# EAGLE design xenlight (EAGLE 6.3)
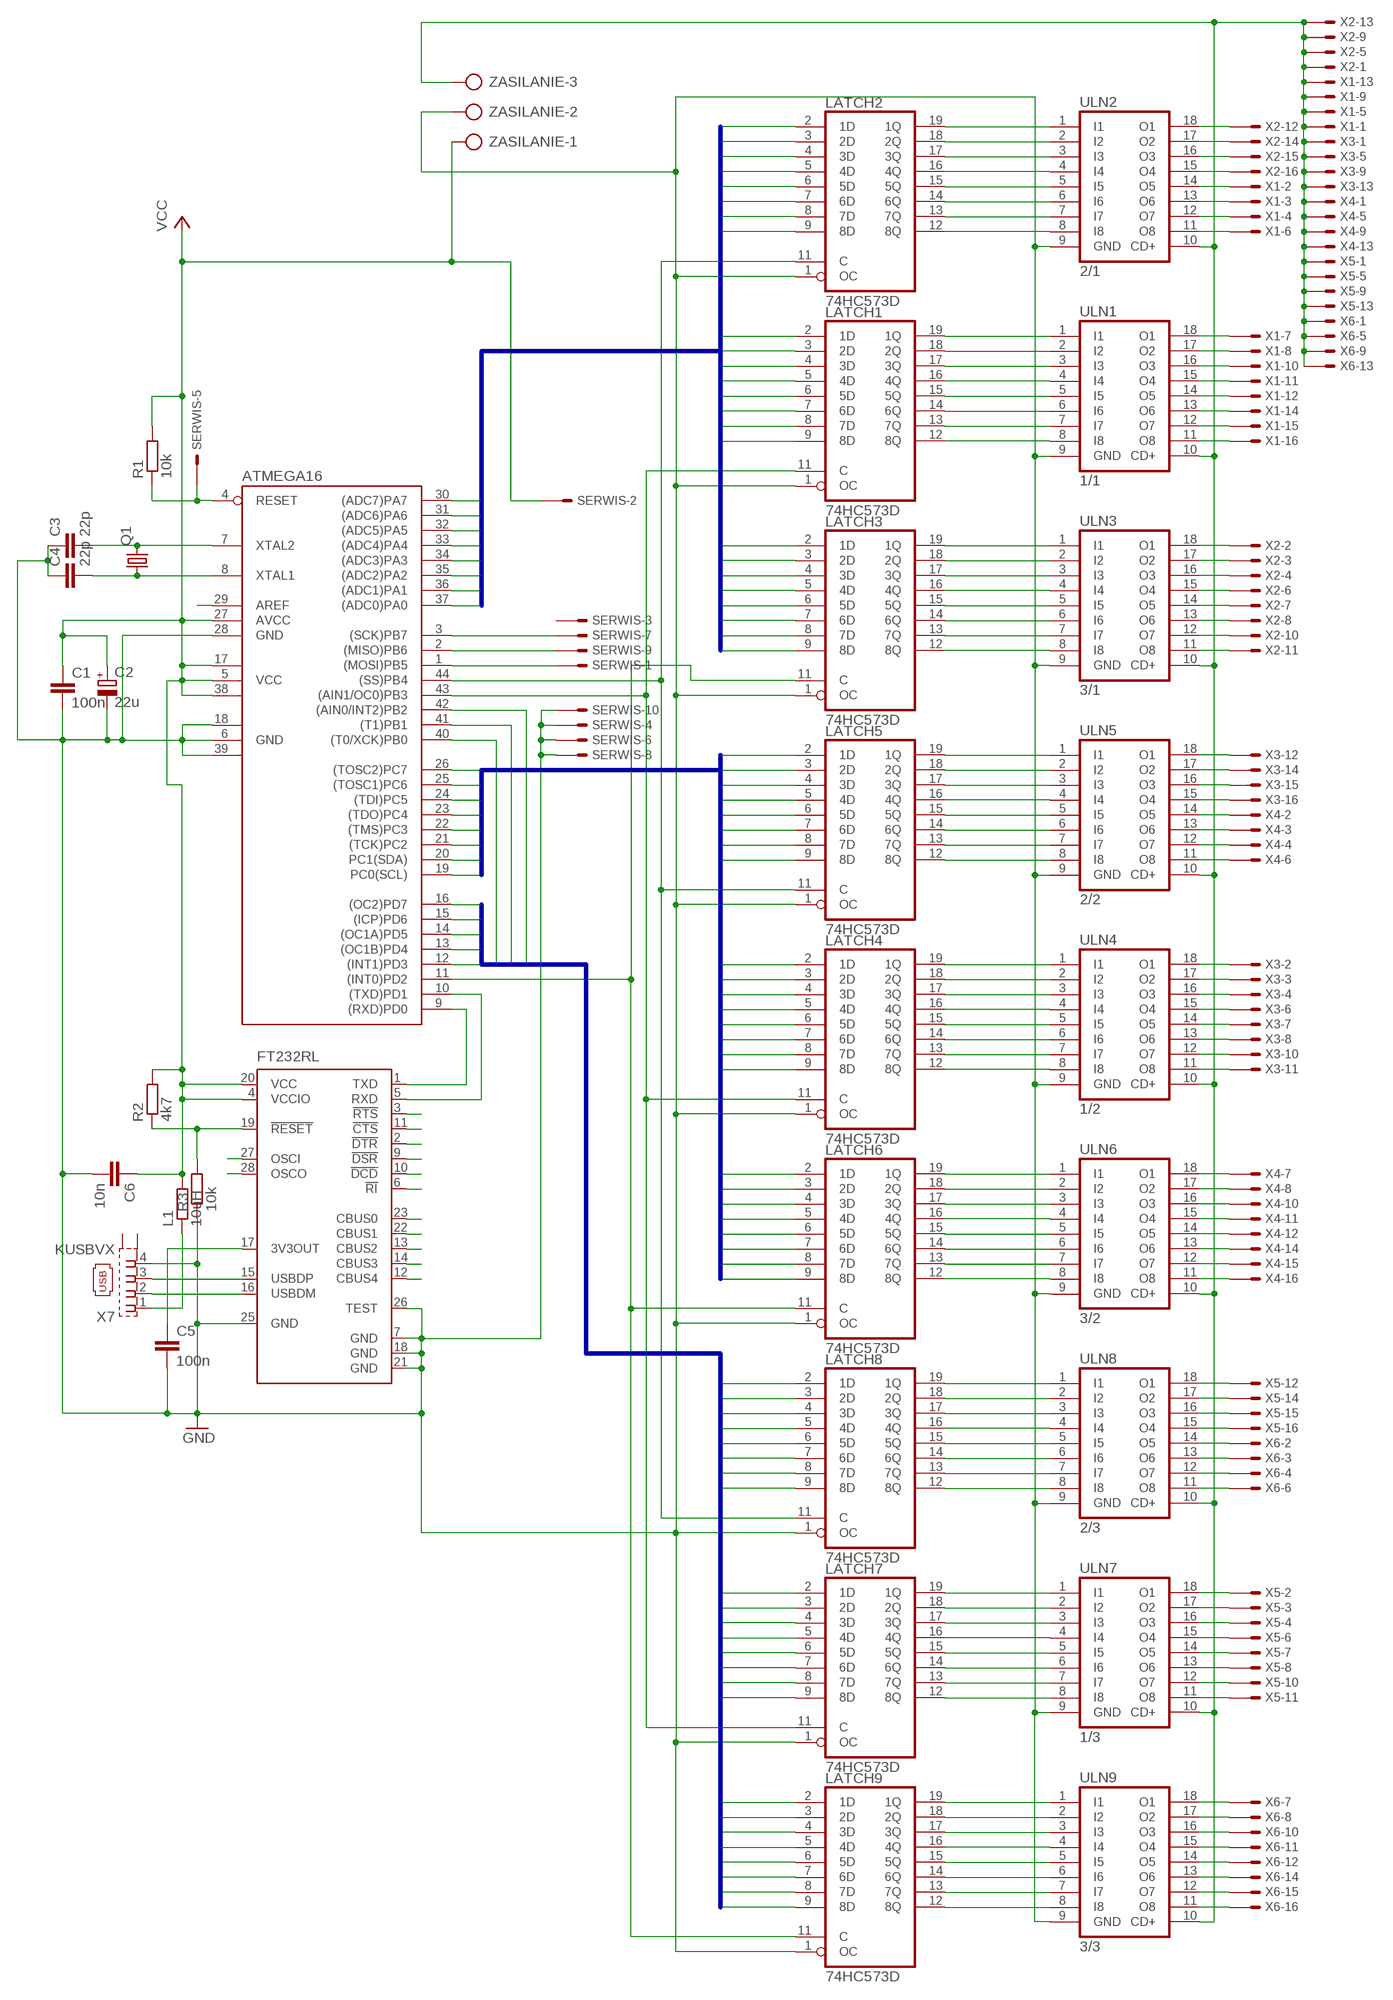
[diagram p0: schematic, sheet 1]

## Parts
ATMEGA16  MEGA16-A  [TQFP44]
C1  100n  C-EUC1206  [C1206]
C2  22u  CPOL-EUE1.8-4  [E1,8-4]
C3  22p  C-EUC1206  [C1206]
C4  22p  C-EUC1206  [C1206]
C5  100n  C-EUC1206  [C1206]
C6  10n  C-EUC1206  [C1206]
FT232RL  FT232RL  [SSOP28]
L1  10uH  R-EU_R1206  [R1206]
LATCH1  74HC573D  [SO20W]
LATCH2  74HC573D  [SO20W]
LATCH3  74HC573D  [SO20W]
LATCH4  74HC573D  [SO20W]
LATCH5  74HC573D  [SO20W]
LATCH6  74HC573D  [SO20W]
LATCH7  74HC573D  [SO20W]
LATCH8  74HC573D  [SO20W]
LATCH9  74HC573D  [SO20W]
Q1  CRYSTALHC49UP  [HC49UP]
R1  10k  R-EU_R0805  [R0805]
R2  4k7  R-EU_R0805  [R0805]
R3  10k  R-EU_R0805  [R0805]
SERWIS  057-010-1  [057-010-1]
ULN1  1/1  ULN2803ASOL18  [SO18W]
ULN2  2/1  ULN2803ASOL18  [SO18W]
ULN3  3/1  ULN2803ASOL18  [SO18W]
ULN4  1/2  ULN2803ASOL18  [SO18W]
ULN5  2/2  ULN2803ASOL18  [SO18W]
ULN6  3/2  ULN2803ASOL18  [SO18W]
ULN7  1/3  ULN2803ASOL18  [SO18W]
ULN8  2/3  ULN2803ASOL18  [SO18W]
ULN9  3/3  ULN2803ASOL18  [SO18W]
X1  057-016-1  [057-016-1]
X2  057-016-1  [057-016-1]
X3  057-016-1  [057-016-1]
X4  057-016-1  [057-016-1]
X5  057-016-1  [057-016-1]
X6  057-016-1  [057-016-1]
X7  KUSBVX  [KUSBVX]
ZASILANIE  AK300/3  [AK300/3]

## Nets
12V: ULN1.10(CD+) ULN2.10(CD+) ULN3.10(CD+) ULN4.10(CD+) ULN5.10(CD+) ULN6.10(CD+) ULN7.10(CD+) ULN8.10(CD+) ULN9.10(CD+) X1.1 X1.5 X1.9 X1.13 X2.1 X2.5 X2.9 X2.13 X3.1 X3.5 X3.9 X3.13 X4.1 X4.5 X4.9 X4.13 X5.1 X5.5 X5.9 X5.13 X6.1 X6.5 X6.9 X6.13 ZASILANIE.3
GND: ATMEGA16.6(GND) ATMEGA16.18(GND1) ATMEGA16.28(GND) ATMEGA16.39(GND2) C1.2 C2.- C3.1 C4.1 C5.2 C6.2 FT232RL.7(GND) FT232RL.18(GND) FT232RL.21(GND) FT232RL.25(GND) FT232RL.26(TEST) LATCH1.1(OC) LATCH2.1(OC) LATCH3.1(OC) LATCH4.1(OC) LATCH5.1(OC) LATCH6.1(OC) LATCH7.1(OC) LATCH8.1(OC) LATCH9.1(OC) R3.1 SERWIS.4 SERWIS.6 SERWIS.8 SERWIS.10 ULN1.9(GND) ULN2.9(GND) ULN3.9(GND) ULN4.9(GND) ULN5.9(GND) ULN6.9(GND) ULN7.9(GND) ULN8.9(GND) ULN9.9(GND) X7.4 ZASILANIE.2
N$1: ATMEGA16.30((ADC7)PA7) LATCH1.9(8D) LATCH2.9(8D) LATCH3.9(8D)
N$2: ATMEGA16.31((ADC6)PA6) LATCH1.8(7D) LATCH2.8(7D) LATCH3.8(7D)
N$3: ATMEGA16.32((ADC5)PA5) LATCH1.7(6D) LATCH2.7(6D) LATCH3.7(6D)
N$4: ATMEGA16.33((ADC4)PA4) LATCH1.6(5D) LATCH2.6(5D) LATCH3.6(5D)
N$5: ATMEGA16.34((ADC3)PA3) LATCH1.5(4D) LATCH2.5(4D) LATCH3.5(4D)
N$6: ATMEGA16.35((ADC2)PA2) LATCH1.4(3D) LATCH2.4(3D) LATCH3.4(3D)
N$7: ATMEGA16.36((ADC1)PA1) LATCH1.3(2D) LATCH2.3(2D) LATCH3.3(2D)
N$8: ATMEGA16.37((ADC0)PA0) LATCH1.2(1D) LATCH2.2(1D) LATCH3.2(1D)
N$9: ATMEGA16.26((TOSC2)PC7) LATCH4.2(1D) LATCH5.2(1D) LATCH6.2(1D)
N$10: ATMEGA16.25((TOSC1)PC6) LATCH4.3(2D) LATCH5.3(2D) LATCH6.3(2D)
N$11: ATMEGA16.24((TDI)PC5) LATCH4.4(3D) LATCH5.4(3D) LATCH6.4(3D)
N$12: ATMEGA16.23((TDO)PC4) LATCH4.5(4D) LATCH5.5(4D) LATCH6.5(4D)
N$13: ATMEGA16.22((TMS)PC3) LATCH4.6(5D) LATCH5.6(5D) LATCH6.6(5D)
N$14: ATMEGA16.21((TCK)PC2) LATCH4.7(6D) LATCH5.7(6D) LATCH6.7(6D)
N$15: ATMEGA16.20(PC1(SDA)) LATCH4.8(7D) LATCH5.8(7D) LATCH6.8(7D)
N$16: ATMEGA16.19(PC0(SCL)) LATCH4.9(8D) LATCH5.9(8D) LATCH6.9(8D)
N$17: ATMEGA16.16((OC2)PD7) LATCH7.2(1D) LATCH8.2(1D) LATCH9.2(1D)
N$18: ATMEGA16.15((ICP)PD6) LATCH7.3(2D) LATCH8.3(2D) LATCH9.3(2D)
N$19: ATMEGA16.14((OC1A)PD5) LATCH7.4(3D) LATCH8.4(3D) LATCH9.4(3D)
N$20: ATMEGA16.13((OC1B)PD4) LATCH7.5(4D) LATCH8.5(4D) LATCH9.5(4D)
N$21: ATMEGA16.12((INT1)PD3) LATCH7.6(5D) LATCH8.6(5D) LATCH9.6(5D)
N$22: ATMEGA16.44((SS)PB4) LATCH2.11(C) LATCH5.11(C) LATCH8.11(C)
N$23: ATMEGA16.43((AIN1/OC0)PB3) LATCH1.11(C) LATCH4.11(C) LATCH7.11(C)
N$24: LATCH2.19(1Q) ULN2.1(I1)
N$25: LATCH2.18(2Q) ULN2.2(I2)
N$26: LATCH2.17(3Q) ULN2.3(I3)
N$27: LATCH2.16(4Q) ULN2.4(I4)
N$28: LATCH2.15(5Q) ULN2.5(I5)
N$29: LATCH2.14(6Q) ULN2.6(I6)
N$30: LATCH2.13(7Q) ULN2.7(I7)
N$31: LATCH2.12(8Q) ULN2.8(I8)
N$32: LATCH1.19(1Q) ULN1.1(I1)
N$33: LATCH1.18(2Q) ULN1.2(I2)
N$34: LATCH1.17(3Q) ULN1.3(I3)
N$35: LATCH1.16(4Q) ULN1.4(I4)
N$36: LATCH1.15(5Q) ULN1.5(I5)
N$37: LATCH1.14(6Q) ULN1.6(I6)
N$38: LATCH1.13(7Q) ULN1.7(I7)
N$39: LATCH1.12(8Q) ULN1.8(I8)
N$40: LATCH5.19(1Q) ULN5.1(I1)
N$41: LATCH5.18(2Q) ULN5.2(I2)
N$42: LATCH5.17(3Q) ULN5.3(I3)
N$43: LATCH5.16(4Q) ULN5.4(I4)
N$44: LATCH5.15(5Q) ULN5.5(I5)
N$45: LATCH5.14(6Q) ULN5.6(I6)
N$46: LATCH5.13(7Q) ULN5.7(I7)
N$47: LATCH3.19(1Q) ULN3.1(I1)
N$48: LATCH4.19(1Q) ULN4.1(I1)
N$49: LATCH4.18(2Q) ULN4.2(I2)
N$50: LATCH4.17(3Q) ULN4.3(I3)
N$51: LATCH4.16(4Q) ULN4.4(I4)
N$52: LATCH4.15(5Q) ULN4.5(I5)
N$53: LATCH4.14(6Q) ULN4.6(I6)
N$54: LATCH4.13(7Q) ULN4.7(I7)
N$55: LATCH4.12(8Q) ULN4.8(I8)
N$56: LATCH8.19(1Q) ULN8.1(I1)
N$57: LATCH8.18(2Q) ULN8.2(I2)
N$58: LATCH8.17(3Q) ULN8.3(I3)
N$59: LATCH8.16(4Q) ULN8.4(I4)
N$60: LATCH8.15(5Q) ULN8.5(I5)
N$61: LATCH3.18(2Q) ULN3.2(I2)
N$62: ULN4.18(O1) X3.2
N$63: LATCH3.17(3Q) ULN3.3(I3)
N$64: LATCH7.19(1Q) ULN7.1(I1)
N$65: LATCH7.18(2Q) ULN7.2(I2)
N$66: LATCH7.17(3Q) ULN7.3(I3)
N$67: LATCH7.16(4Q) ULN7.4(I4)
N$68: LATCH7.15(5Q) ULN7.5(I5)
N$69: LATCH3.16(4Q) ULN3.4(I4)
N$70: LATCH3.15(5Q) ULN3.5(I5)
N$71: LATCH3.14(6Q) ULN3.6(I6)
N$72: LATCH3.13(7Q) ULN3.7(I7)
N$73: LATCH3.12(8Q) ULN3.8(I8)
N$74: ATMEGA16.11((INT0)PD2) LATCH3.11(C) LATCH6.11(C) LATCH9.11(C)
N$75: LATCH6.19(1Q) ULN6.1(I1)
N$76: LATCH6.18(2Q) ULN6.2(I2)
N$77: LATCH6.17(3Q) ULN6.3(I3)
N$78: LATCH6.16(4Q) ULN6.4(I4)
N$79: LATCH6.15(5Q) ULN6.5(I5)
N$80: LATCH6.14(6Q) ULN6.6(I6)
N$81: LATCH6.13(7Q) ULN6.7(I7)
N$82: LATCH6.12(8Q) ULN6.8(I8)
N$83: ATMEGA16.29(AREF)
N$84: LATCH9.19(1Q) ULN9.1(I1)
N$85: LATCH9.18(2Q) ULN9.2(I2)
N$86: LATCH9.17(3Q) ULN9.3(I3)
N$87: LATCH9.16(4Q) ULN9.4(I4)
N$88: LATCH9.15(5Q) ULN9.5(I5)
N$89: LATCH9.14(6Q) ULN9.6(I6)
N$90: LATCH9.13(7Q) ULN9.7(I7)
N$91: LATCH9.12(8Q) ULN9.8(I8)
N$92: ULN3.18(O1) X2.2
N$93: ULN3.17(O2) X2.3
N$94: ULN3.16(O3) X2.4
N$95: ULN3.15(O4) X2.6
N$96: ULN3.14(O5) X2.7
N$97: ULN3.13(O6) X2.8
N$98: ULN3.12(O7) X2.10
N$99: ULN3.11(O8) X2.11
N$100: ULN2.18(O1) X2.12
N$101: ULN2.17(O2) X2.14
N$102: ULN2.16(O3) X2.15
N$103: ULN2.15(O4) X2.16
N$104: ULN2.14(O5) X1.2
N$105: ATMEGA16.3((SCK)PB7) SERWIS.7
N$106: ATMEGA16.2((MISO)PB6) SERWIS.9
N$107: ATMEGA16.1((MOSI)PB5) SERWIS.1
N$108: ULN2.13(O6) X1.3
N$109: ULN2.12(O7) X1.4
N$110: LATCH5.12(8Q) ULN5.8(I8)
N$111: ULN2.11(O8) X1.6
N$112: ULN1.18(O1) X1.7
N$113: ULN1.17(O2) X1.8
N$115: ULN1.16(O3) X1.10
N$116: ULN1.15(O4) X1.11
N$117: ATMEGA16.8(XTAL1) C4.2 Q1.1
N$118: ATMEGA16.7(XTAL2) C3.2 Q1.2
N$119: FT232RL.15(USBDP) X7.3
N$120: ATMEGA16.9((RXD)PD0) FT232RL.1(TXD)
N$121: ATMEGA16.10((TXD)PD1) FT232RL.5(RXD)
N$122: FT232RL.16(USBDM) X7.2
N$123: L1.1 X7.1
N$124: LATCH8.14(6Q) ULN8.6(I6)
N$125: FT232RL.19(!RESET) R2.1 R3.2
N$126: C5.1 FT232RL.17(3V3OUT)
N$127: ATMEGA16.4(RESET) R1.1 SERWIS.5
N$128: LATCH8.13(7Q) ULN8.7(I7)
N$129: LATCH8.12(8Q) ULN8.8(I8)
N$130: LATCH7.14(6Q) ULN7.6(I6)
N$131: LATCH7.13(7Q) ULN7.7(I7)
N$132: LATCH7.12(8Q) ULN7.8(I8)
N$133: ULN1.14(O5) X1.12
N$134: ULN1.13(O6) X1.14
N$135: ULN1.12(O7) X1.15
N$136: ULN1.11(O8) X1.16
N$137: ULN4.17(O2) X3.3
N$138: FT232RL.3(!RTS)
N$139: FT232RL.11(!CTS)
N$140: FT232RL.2(!DTR)
N$141: FT232RL.9(!DSR)
N$142: FT232RL.10(!DCD)
N$143: FT232RL.6(!RI)
N$144: ATMEGA16.42((AIN0/INT2)PB2) LATCH7.7(6D) LATCH8.7(6D) LATCH9.7(6D)
N$145: ATMEGA16.41((T1)PB1) LATCH7.8(7D) LATCH8.8(7D) LATCH9.8(7D)
N$146: ATMEGA16.40((T0/XCK)PB0) LATCH7.9(8D) LATCH8.9(8D) LATCH9.9(8D)
N$147: FT232RL.23(CBUS0)
N$148: FT232RL.22(CBUS1)
N$149: FT232RL.13(CBUS2)
N$150: FT232RL.14(CBUS3)
N$151: FT232RL.12(CBUS4)
N$152: FT232RL.27(OSCI)
N$153: FT232RL.28(OSCO)
N$154: ULN4.16(O3) X3.4
N$155: ULN4.15(O4) X3.6
N$156: ULN4.14(O5) X3.7
N$157: ULN4.13(O6) X3.8
N$158: ULN4.12(O7) X3.10
N$159: ULN4.11(O8) X3.11
N$160: ULN5.18(O1) X3.12
N$161: ULN5.17(O2) X3.14
N$162: ULN5.16(O3) X3.15
N$163: ULN5.15(O4) X3.16
N$164: ULN5.14(O5) X4.2
N$165: ULN5.13(O6) X4.3
N$166: ULN5.12(O7) X4.4
N$167: ULN5.11(O8) X4.6
N$168: ULN6.18(O1) X4.7
N$169: ULN6.17(O2) X4.8
N$170: ULN6.16(O3) X4.10
N$171: ULN6.15(O4) X4.11
N$172: ULN6.14(O5) X4.12
N$173: ULN6.13(O6) X4.14
N$174: ULN6.12(O7) X4.15
N$175: ULN6.11(O8) X4.16
N$176: ULN7.18(O1) X5.2
N$177: ULN7.17(O2) X5.3
N$178: ULN7.16(O3) X5.4
N$179: ULN7.15(O4) X5.6
N$180: ULN7.14(O5) X5.7
N$181: ULN7.13(O6) X5.8
N$182: ULN7.12(O7) X5.10
N$183: ULN7.11(O8) X5.11
N$184: ULN8.18(O1) X5.12
N$185: ULN8.17(O2) X5.14
N$186: ULN8.16(O3) X5.15
N$187: ULN8.15(O4) X5.16
N$188: ULN8.14(O5) X6.2
N$189: ULN8.13(O6) X6.3
N$190: ULN8.12(O7) X6.4
N$191: ULN8.11(O8) X6.6
N$192: ULN9.18(O1) X6.7
N$193: ULN9.17(O2) X6.8
N$194: ULN9.16(O3) X6.10
N$195: ULN9.15(O4) X6.11
N$196: ULN9.14(O5) X6.12
N$197: ULN9.13(O6) X6.14
N$198: ULN9.12(O7) X6.15
N$199: ULN9.11(O8) X6.16
VCC: ATMEGA16.5(VCC) ATMEGA16.17(VCC1) ATMEGA16.27(AVCC) ATMEGA16.38(VCC2) C1.1 C2.+ C6.1 FT232RL.4(VCCIO) FT232RL.20(VCC) L1.2 R1.2 R2.2 SERWIS.2 ZASILANIE.1
Unconnected: SERWIS.3 X7.M1(S1) X7.M2(S2)

## Buses
N$[9..16]
N$[1..8]
N$[17..21],N$[144..146]

## Power pins joined to a net without a drawn wire
GND: LATCH1.10(GND) LATCH2.10(GND) LATCH3.10(GND) LATCH4.10(GND) LATCH5.10(GND) LATCH6.10(GND) LATCH7.10(GND) LATCH8.10(GND) LATCH9.10(GND)
VCC: LATCH1.20(VCC) LATCH2.20(VCC) LATCH3.20(VCC) LATCH4.20(VCC) LATCH5.20(VCC) LATCH6.20(VCC) LATCH7.20(VCC) LATCH8.20(VCC) LATCH9.20(VCC)

## Library data of the parts
ATMEGA16 = atmel:MEGA16: MICROCONTROLLER 16 Kbytes FLASH 1 kbytes SRAM 512 bytes EEPROM USART 8-channel 10 bit ADC Source: avr.lbr; MPN: ATMEGA16-16AU; OC_FARNELL: 9171134; OC_NEWARK: 96K6515
C1 C3-C6 = rcl:C-EU: CAPACITOR, European symbol
C2 = rcl:CPOL-EU: POLARIZED CAPACITOR, European symbol
FT232RL = ftdichip:FT232R: Source: http://www.ftdichip.com/Documents/DataSheets/DS_FT232R_v104.pdf; MPN: FT232RL; OC_FARNELL: 1146032; OC_NEWARK: 91K9918
L1 R1-R3 = rcl:R-EU_: RESISTOR, European symbol
LATCH1-LATCH9 = 74xx-eu:74*573: 8-bit D latch BUS DRIVER
Q1 = crystal:CRYSTAL: CRYSTAL; OC_FARNELL: unknown; OC_NEWARK: unknown
SERWIS = con-panduit:057-010-: CONNECTOR 10-pin series 057 contact pc board low profile headers; OC_FARNELL: unknown; OC_NEWARK: unknown
ULN1-ULN9 = uln-udn2:ULN2803A: DRIVER ARRAY
X1-X6 = con-panduit:057-016-: CONNECTOR 10-pin series 057 contact pc board low profile headers; OC_FARNELL: unknown; OC_NEWARK: unknown
X7 = con-kycon:KUSBVX: Vertical,Top Entry Universal Serial Bus Connector KUSBVX Series Source: KYCON Sibalco USB vertical socket KUSBV.pdf
ZASILANIE = con-ptr500:AK300/3: CONNECTOR; OC_FARNELL: unknown; OC_NEWARK: unknown

## Board
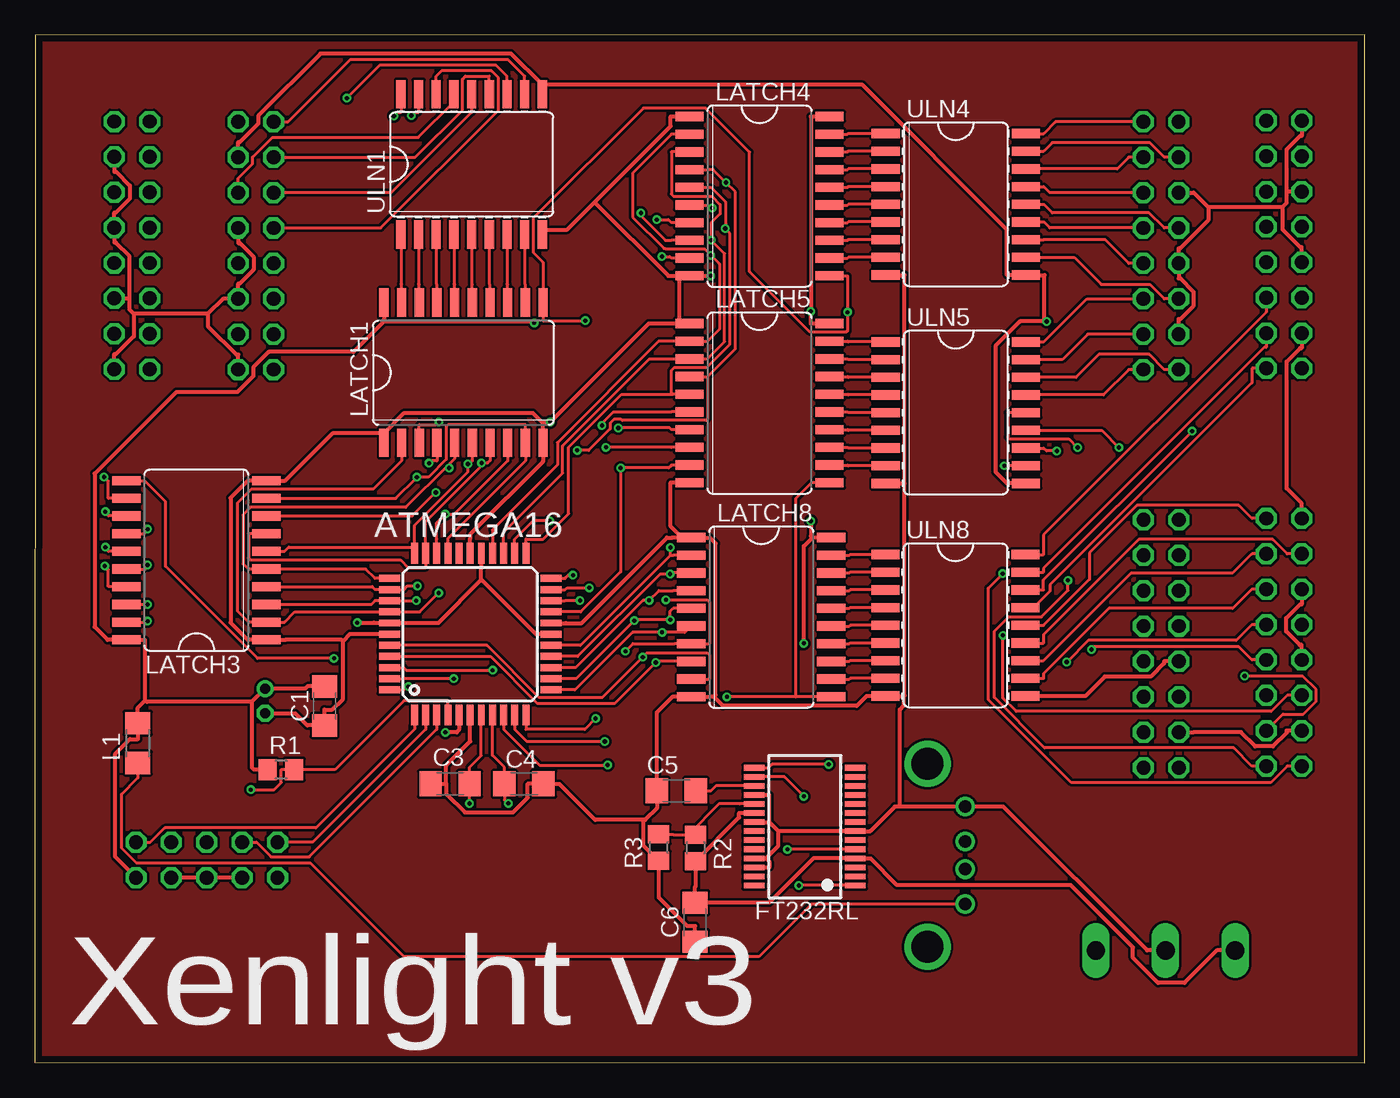
[diagram p1: board, top side]
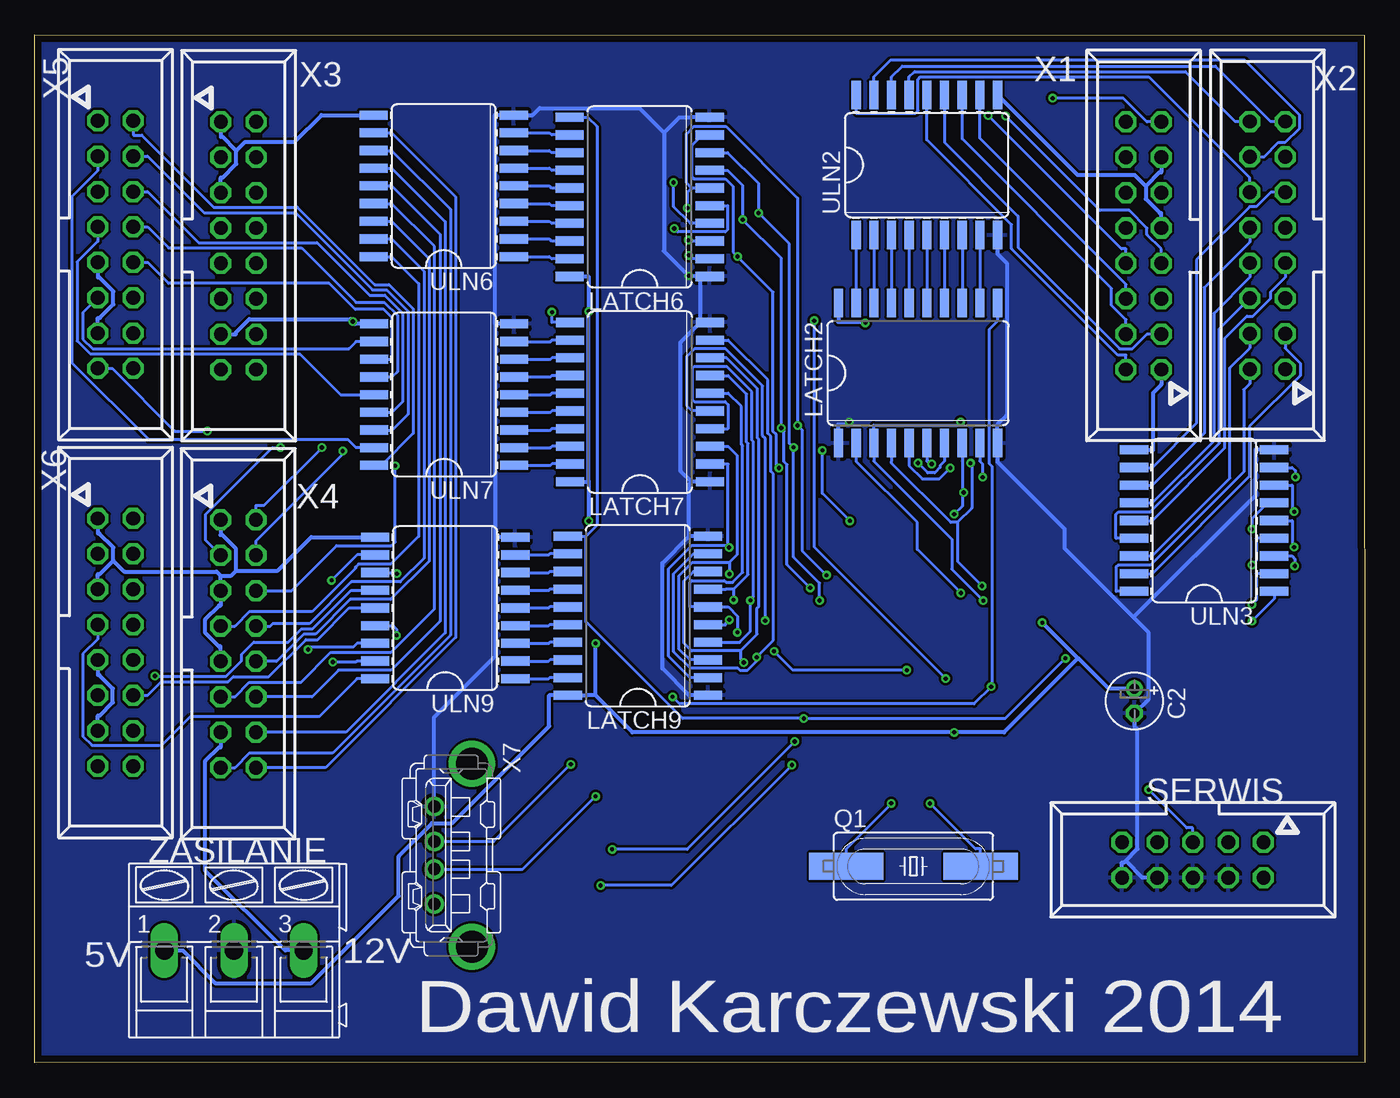
[diagram p2: board, bottom side, seen from below]

Size 95.51 x 73.81 mm. Coordinates in mm from the lower left corner, seen from the top.
Outline: 0,0.05 95.51,0 95.51,73.81 0.02,73.79 0,0.05
Copper layers (1*16): Top 0.035mm / dielectric 1.5mm / Bottom 0.035mm
Design rules "EagleRules_SmartPrototyping": minimum track width 7mil, minimum drill 12mil, track to track 7mil, track to pad 7mil, pad to pad 7mil, via to via 7mil, smd to smd 0mil, copper to edge 20mil, drill to drill 10mil, minimum pad ring 10mil, minimum via ring 6mil, stop-mask expansion 2mil, vias tented up to drill 25mil, thermal gap 10mil

### Footprints (pad centres in the part's own frame; a part is rotated, then mirrored left to right if it is on the bottom)
TQFP44 = smd 1.5 x 0.5: 1 -5.8,4; 2 -5.8,3.2; 3 -5.8,2.4; 4 -5.8,1.6; 5 -5.8,0.8; 6 -5.8,0; 7 -5.8,-0.8; 8 -5.8,-1.6; 9 -5.8,-2.4; 10 -5.8,-3.2; 11 -5.8,-4; 23 5.8,-4; 24 5.8,-3.2; 25 5.8,-2.4; 26 5.8,-1.6; 27 5.8,-0.8; 28 5.8,0; 29 5.8,0.8; 30 5.8,1.6; 31 5.8,2.4; 32 5.8,3.2; 33 5.8,4 | smd 0.5 x 1.5: 12 -4,-5.8; 13 -3.2,-5.8; 14 -2.4,-5.8; 15 -1.6,-5.8; 16 -0.8,-5.8; 17 0,-5.8; 18 0.8,-5.8; 19 1.6,-5.8; 20 2.4,-5.8; 21 3.2,-5.8; 22 4,-5.8; 34 4,5.8; 35 3.2,5.8; 36 2.4,5.8; 37 1.6,5.8; 38 0.8,5.8; 39 0,5.8; 40 -0.8,5.8; 41 -1.6,5.8; 42 -2.4,5.8; 43 -3.2,5.8; 44 -4,5.8
C1206 = smd 1.6 x 1.8: 1 -1.4,0; 2 1.4,0
E1,8-4 = drill 0.711 pad 1.168: + -0.889,0 | drill 0.711 pad 1.168 octagon: - 0.889,0
SSOP28 = smd 0.4 x 1.5: 1 -4.225,-3.625; 2 -3.575,-3.625; 3 -2.925,-3.625; 4 -2.275,-3.625; 5 -1.625,-3.625; 6 -0.975,-3.625; 7 -0.325,-3.625; 8 0.325,-3.625; 9 0.975,-3.625; 10 1.625,-3.625; 11 2.275,-3.625; 12 2.925,-3.625; 13 3.575,-3.625; 14 4.225,-3.625; 15 4.225,3.625; 16 3.575,3.625; 17 2.925,3.625; 18 2.275,3.625; 19 1.625,3.625; 20 0.975,3.625; 21 0.325,3.625; 22 -0.325,3.625; 23 -0.975,3.625; 24 -1.625,3.625; 25 -2.275,3.625; 26 -2.925,3.625; 27 -3.575,3.625; 28 -4.225,3.625
R1206 = smd 1.6 x 1.803: 1 -1.422,0; 2 1.422,0
SO20W = smd 0.66 x 2.032: 1 -5.715,-5.029; 2 -4.445,-5.029; 3 -3.175,-5.029; 4 -1.905,-5.029; 5 -0.635,-5.029; 6 0.635,-5.029; 7 1.905,-5.029; 8 3.175,-5.029; 9 4.445,-5.029; 10 5.715,-5.029; 11 5.715,5.029; 12 4.445,5.029; 13 3.175,5.029; 14 1.905,5.029; 15 0.635,5.029; 16 -0.635,5.029; 17 -1.905,5.029; 18 -3.175,5.029; 19 -4.445,5.029; 20 -5.715,5.029
HC49UP = smd 5.334 x 1.93: 1 -4.826,0; 2 4.826,0
R0805 = smd 1.3 x 1.5: 1 -0.95,0; 2 0.95,0
057-010-1 = drill 1 octagon: 1 -5.08,-1.27; 2 -5.08,1.27; 3 -2.54,-1.27; 4 -2.54,1.27; 5 0,-1.27; 6 0,1.27; 7 2.54,-1.27; 8 2.54,1.27; 9 5.08,-1.27; 10 5.08,1.27
SO18W = smd 0.66 x 2.032: 1 -5.08,-5.029; 2 -3.81,-5.029; 3 -2.54,-5.029; 4 -1.27,-5.029; 5 0,-5.029; 6 1.27,-5.029; 7 2.54,-5.029; 8 3.81,-5.029; 9 5.08,-5.029; 10 5.08,5.029; 11 3.81,5.029; 12 2.54,5.029; 13 1.27,5.029; 14 0,5.029; 15 -1.27,5.029; 16 -2.54,5.029; 17 -3.81,5.029; 18 -5.08,5.029
057-016-1 = drill 1 octagon: 1 -8.89,-1.27; 2 -8.89,1.27; 3 -6.35,-1.27; 4 -6.35,1.27; 5 -3.81,-1.27; 6 -3.81,1.27; 7 -1.27,-1.27; 8 -1.27,1.27; 9 1.27,-1.27; 10 1.27,1.27; 11 3.81,-1.27; 12 3.81,1.27; 13 6.35,-1.27; 14 6.35,1.27; 15 8.89,-1.27; 16 8.89,1.27
KUSBVX = drill 0.9 pad 1.3: 1 3.5,0; 2 1,0; 3 -1,0; 4 -3.5,0 | drill 2.3 pad 2.8: M1 -6.57,2.71; M2 6.57,2.71
AK300/3 = drill 1.321 long: 1 -5.004,0; 2 0,0; 3 5.004,0

### Placement (x,y rotation side)
ATMEGA16  31.27,30.78 90 top
C1  20.8,25.63 270 top
C2  16.54,25.98 270 bottom
C3  29.82,20.04 0 top
C4  35.13,20.04 180 top
C5  46.08,19.53 180 top
C6  47.42,10.11 270 top
FT232RL  55.3,16.97 90 top
L1  7.39,22.96 90 top
LATCH1  30.78,49.56 0 top
LATCH2  32.08,49.53 0 bottom
LATCH3  11.61,36.09 90 top
LATCH4  52.04,62.23 270 top
LATCH5  52.04,47.37 270 top
LATCH6  52.07,62.18 90 bottom
LATCH7  52.04,47.45 90 bottom
LATCH8  52.17,32 270 top
LATCH9  52.2,32.11 90 bottom
Q1  32.41,14.12 0 bottom
R1  17.68,21.06 180 top
R2  47.45,15.44 270 top
R3  44.81,15.47 90 top
SERWIS  12.34,14.58 180 bottom
ULN1  31.37,64.52 0 top
ULN2  31.45,64.47 0 bottom
ULN3  11.53,38.94 90 bottom
ULN4  66.14,61.65 270 top
ULN5  66.14,46.69 270 top
ULN6  66.14,62.97 90 bottom
ULN7  66.12,47.98 90 bottom
ULN8  66.12,31.42 270 top
ULN9  66.04,32.66 90 bottom
X1  15.87,58.67 90 bottom
X2  6.99,58.7 90 bottom
X3  80.87,58.67 270 bottom
X4  80.9,30.1 270 bottom
X5  89.71,58.75 270 bottom
X6  89.71,30.2 270 bottom
X7  66.83,14.91 270 bottom
ZASILANIE  81.2,8.08 0 bottom

### Tracks (layer width: path | path; a pad name or v marks a point on that pad's centre or on a via)
12V  (via drill 0.3 pad 0.61)
  Top 0.305: X1.9 14.6,58.86 14.74,58.86 15.72,57.88 15.72,56.95 14.72,55.95 14.6,55.95 X1.5 13.52,54.86 12.43,53.77 | 36.45,70.22 34.2,72.47 20.52,72.47 16.05,68 16.05,67.44 14.72,66.11 14.6,66.11 X1.13 | 36.45,70.22 59.44,70.22 69.82,59.83 69.82,56.57 ULN4.10 72.52,56.57 72.52,53.24 | 72.52,53.24 v72.67,53.24 | 72.52,53.24 70.76,53.24 69,51.47 69,42.43 69.82,41.6 ULN5.10 | ULN1.10 36.45,70.22 | X5.1 90.98,66.56 90.87,66.56 89.9,65.58 89.9,62.56 | 89.59,61.44 89.9,61.75 89.9,62.56 | X6.5 90.98,32.93 90.87,32.93 89.87,31.93 89.87,30.99 90.85,30.02 90.98,30.02 X6.9 | X4.9 81.09,28.83 81.09,28.69 80.14,27.75 76.84,27.75 75.43,26.34 ULN8.10 | X2.13 5.71,63.96 5.85,63.96 6.83,62.99 6.83,62.05 5.83,61.05 5.71,61.05 X2.9 5.71,58.88 5.83,58.88 6.8,57.91 6.8,54.89 | 7.11,53.77 6.8,54.08 6.8,54.89 | 7.11,53.77 7.11,52.17 5.83,50.89 5.71,50.89 X2.1 | 12.43,53.77 7.11,53.77 | X5.13 90.98,51.32 90.87,51.32 89.9,50.34 89.9,41.26 90.98,40.17 X6.1 | 89.59,61.44 89.59,59.84 90.87,58.56 90.98,58.56 X5.9 | 89.59,61.44 84.27,61.44 | X3.13 82.14,53.41 82.28,53.41 83.23,54.36 83.23,55.34 82.26,56.32 82.14,56.32 X3.9 82.14,58.49 82.26,58.49 84.27,60.5 84.27,61.44 | 84.27,61.44 83.23,62.48 X3.5 | 12.43,53.77 12.43,52.9 14.46,50.87 14.6,50.87 X1.1 | X2.5 6.8,54.89 | X5.5 89.9,62.56 | X4.13 83.25,23.75 86.62,23.75 87.64,22.73 88.91,22.73 89.9,23.71 89.9,23.85 X6.13
  Bottom 0.305: X6.9 90.98,27.85 90.87,27.85 89.9,26.87 89.9,25.88 90.85,24.94 90.98,24.94 X6.13 | X4.9 82.17,29.91 82.3,29.91 83.26,30.87 83.26,31.85 82.28,32.82 82.17,32.82 X4.5 82.17,34.99 | 89.87,36.07 89.87,37.01 90.87,38.01 90.98,38.01 X6.1 | 89.87,36.07 90.85,35.09 90.98,35.09 X6.5 | 89.87,36.07 89.08,35.28 82.46,35.28 82.17,34.99 | ULN7.10 72.49,53.06 v72.67,53.24 72.84,53.41 80.11,53.41 81.06,52.46 81.06,52.32 X3.13 | 81.06,35.34 81.06,36.91 82.06,37.9 82.17,37.9 X4.1 | 82.17,34.99 81.41,34.99 81.06,35.34 | 81.06,35.34 78.06,35.34 75.66,37.74 ULN9.10 | 15.73,62.95 15.73,62.04 14.72,61.03 14.6,61.03 X1.9 | 15.73,62.95 14.74,63.94 14.6,63.94 X1.13 | ULN2.10 20.62,63.75 16.54,63.75 15.73,62.95 | X5.9 90.98,56.4 90.87,56.4 89.87,55.4 89.87,54.46 90.85,53.48 90.98,53.48 X5.13 | X4.13 82.17,22.67 82.28,22.67 83.26,21.69 83.26,13.82 77.52,8.08 ZASILANIE.3 | ULN3.10 15.21,44.02 15.21,48.09 14.6,48.7 X1.1 | 81.03,65.48 82.03,66.48 82.14,66.48 X3.1 | 81.03,65.48 81.03,64.54 82.01,63.57 82.14,63.57 X3.5 | 81.03,65.48 80.39,66.12 76.84,66.12 74.91,68.05 ULN6.10
GND  (via drill 0.3 pad 0.61)
  Top 0.305: LATCH5.10 45.67,41.66 45.67,38.52 46.47,37.72 | 46.47,37.72 45.8,37.72 45.4,37.72 39.27,31.59 38.15,31.59 ATMEGA16.18 | 46.47,37.72 LATCH8.1 48.49,37.72 48.9,37.31 48.9,26.42 48.76,26.29 | 62.46,41.6 62.46,56.57 ULN4.9 | 62.43,26.34 62.46,26.37 62.46,41.6 | ULN5.9 62.46,41.6 | v48.55,56.52 48.36,56.52 LATCH4.10 46.26,56.52 | 46.26,53.09 44.08,53.09 v37.03,46.03 36.61,46.03 36.5,45.93 | LATCH5.1 46.26,53.09 | 40.21,61.8 45.5,56.52 46.26,56.52 | 46.26,56.52 46.26,53.09 | LATCH4.1 45.67,67.95 45.67,67.26 40.21,61.8 | 40.21,61.8 38.23,59.82 36.45,59.82 ULN1.9 | 25.07,45.2 26.54,46.67 35.76,46.67 36.5,45.93 | 36.5,45.93 36.5,45.87 LATCH1.10 36.5,43.18 31.27,37.95 31.27,37.66 ATMEGA16.28 | 62.12,18.41 62.12,25.37 62.43,25.68 62.43,26.34 | 62.43,26.34 ULN8.9 59.74,26.34 59.03,25.63 49.42,25.63 48.76,26.29 | 48.76,26.29 48.49,26.29 LATCH8.10 45.8,26.29 44.68,25.17 C5.2 44.68,18.3 43.83,17.46 43.69,17.46 | 62.12,18.41 61.77,18.41 60,16.64 FT232RL.7 53.4,16.64 | 62.12,18.41 X7.4 69.55,18.41 79.88,8.08 ZASILANIE.2 | 25.07,45.2 21.37,45.2 17.98,41.81 LATCH3.10 15.29,41.81 14.05,40.57 14.05,31.62 15.29,30.38 LATCH3.1 17.98,30.38 22.04,30.38 22.13,30.29 | 22.13,30.29 22.13,26.12 21.37,25.36 20.8,25.36 C1.2 19.57,24.23 18.71,25.1 C2.- | ATMEGA16.39 22.62,30.79 22.13,30.29 | 43.69,17.46 40.24,17.46 37.66,20.04 C4.1 35.4,20.04 35.4,19.05 34.34,18 30.89,18 29.55,19.33 29.55,20.04 | 43.69,17.46 43.69,15.63 R3.1 44.81,13.54 44.81,11.89 46.86,9.84 47.42,9.84 C6.2 | 53.4,16.64 52.75,17.29 | 52.5,14.69 53.4,15.59 53.4,16.64 | 52.5,14.69 52.75,14.44 52.75,14.04 FT232RL.26 | 52.5,14.69 52.21,14.69 FT232RL.25
  Top 0.305: 29.55,20.04 29.55,21.36 31.27,23.08 ATMEGA16.6 | LATCH1.1 25.07,45.2 | C3.1 29.55,20.04 | 52.75,17.29 52.75,19.24 FT232RL.18 | FT232RL.21 52.75,17.29 | SERWIS.4 SERWIS.6 SERWIS.8
  Bottom 0.305: 47.69,56.46 47.74,56.52 v48.55,56.52 50.32,58.29 50.32,66.8 | 48.36,41.73 49.12,42.49 49.12,51.73 47.69,53.16 | v37.03,46.03 37.21,45.85 37.79,45.85 LATCH2.1 | 47.69,53.16 47.69,56.46 | 48.51,37.82 50.44,35.89 50.44,28.32 48.51,26.39 LATCH9.1 | ULN2.9 26.37,58.09 25.71,57.43 25.71,46.51 26.37,45.85 LATCH2.10 26.37,43.15 21.54,38.33 21.54,36.93 16.6,31.99 | 62.43,53.06 62.46,53.09 62.46,68.05 ULN6.9 59.77,68.05 59.26,68.56 52.09,68.56 50.32,66.8 | 62.43,37.74 62.43,53.06 | 62.43,37.74 62.36,37.74 ULN9.9 | X7.4 66.83,24.83 62.43,29.23 62.43,37.74 | ULN7.9 62.43,53.06 | 50.32,66.8 49.22,67.89 48.39,67.89 LATCH6.10 | LATCH9.10 48.51,37.82 | 48.51,37.82 48.51,41.58 48.36,41.73 | LATCH7.1 48.36,41.73 | LATCH6.1 47.69,56.46 | LATCH7.10 47.69,53.16 | 16.6,31.99 15.54,30.93 15.54,26.09 C2.- 16.54,24.16 16.32,23.94 16.32,15.36 17.17,14.51 | 16.6,31.99 7.85,40.74 7.85,44.02 ULN3.9 | 17.17,14.51 17.29,14.39 17.42,14.39 SERWIS.10 | 17.17,14.51 15.97,13.31 SERWIS.8
  pour Bottom: 0.03,0.05 95.38,0.05 95.4,73.76 0,73.79
N$1  (via drill 0.3 pad 0.61)
  Top 0.203: LATCH3.9 25.92,40.54 v27.44,42.06 28.27,42.06 29.54,43.33 29.54,45.68 29.69,45.82 35.23,45.82 LATCH1.9 35.23,44.38 35.23,43.23 29.67,37.67 29.67,37.61 ATMEGA16.30
  Bottom 0.203: v27.44,42.06 27.44,43.01 27.64,43.2 LATCH2.9 | v27.44,42.06
N$2  (via drill 0.3 pad 0.61)
  Top 0.203: LATCH3.8 27.11,39.27 v28.8,40.96 | ATMEGA16.31 28.87,37.61 28.87,38.78 v29.49,39.4 30.12,39.4 33.96,43.23 LATCH1.8
  Bottom 0.203: 28.91,40.96 28.91,39.98 v29.49,39.4 | 28.91,40.96 28.91,43.2 LATCH2.8 | v28.8,40.96 28.91,40.96
N$3  (via drill 0.3 pad 0.61)
  Top 0.203: LATCH1.7 32.69,43.23 32.53,43.07 v32.08,43.07 32.08,42.88 28.07,38.86 ATMEGA16.32 28.07,35.55 26.83,35.55 26.26,36.12 15.49,36.12 15.34,36.27 15.34,38 LATCH3.7
  Bottom 0.203: LATCH2.7 30.18,43.2 30.49,42.89 30.49,42.75 30.88,42.37 31.38,42.37 v32.08,43.07
N$4  (via drill 0.3 pad 0.61)
  Top 0.203: LATCH1.6 31.42,43.23 31.34,43.23 v31.1,42.99 31.1,42.44 27.27,38.6 27.27,37.03 | 27.27,37.03 18.23,37.03 17.93,36.73 LATCH3.6 | 27.27,37.03 27.27,36.7 ATMEGA16.33
  Bottom 0.203: v31.1,42.99 31.31,43.2 31.45,43.2 LATCH2.6
N$5  (via drill 0.3 pad 0.61)
  Top 0.203: 29.63,42.86 26.65,39.88 15.48,39.88 14.96,39.36 14.96,35.84 15.34,35.46 LATCH3.5 23.76,35.46 24.44,34.78 ATMEGA16.34 | 29.63,42.86 30.15,43.38 30.15,43.88 30.15,44.2 LATCH1.5 | 29.63,42.86 v29.76,42.72
  Bottom 0.203: LATCH2.5 32.71,42.88 31.77,41.93 30.55,41.93 v29.76,42.72
N$6  (via drill 0.3 pad 0.61)
  Top 0.203: v28.31,43.06 28.48,43.23 28.88,43.23 LATCH1.4 | v27.48,34.24 26.76,34.24 26.5,33.98 ATMEGA16.35 24.44,33.98 24.23,34.19 LATCH3.4
  Bottom 0.203: v28.31,43.06 28.21,42.97 28.21,39.84 29.24,38.81 | 29.24,38.81 29.73,38.81 33.98,43.07 33.98,43.2 33.98,43.85 LATCH2.4 | 29.24,38.81 29.24,36 v27.48,34.24
N$7  (via drill 0.3 pad 0.61)
  Top 0.203: LATCH1.3 27.61,45.82 28.83,45.82 v29.03,46.03 | LATCH3.3 24.17,32.92 24.44,33.18 ATMEGA16.36 v27.39,33.18
  Bottom 0.203: v29.03,46.03 29.27,45.8 35.25,45.8 LATCH2.3 35.25,43.85 35.25,43.2 29.66,37.61 29.66,35.46 v27.39,33.18
N$8  (via drill 0.3 pad 0.61)
  Top 0.203: v29,33.75 27.64,32.38 ATMEGA16.37 18.67,32.38 17.93,31.65 LATCH3.2 15.34,31.65 14.54,32.45 14.54,40.18 15.55,41.2 24.31,41.2 26.34,43.23 LATCH1.2
  Bottom 0.203: LATCH2.2 36.52,43.2 32.13,38.81 32.13,36.87 v29,33.75
N$9  (via drill 0.3 pad 0.61)
  Top 0.203: ATMEGA16.26 32.87,38.27 37.53,42.93 37.53,44.54 44.8,51.82 LATCH5.2 48.31,51.82 49.16,52.67 49.16,57.37 v48.55,57.98 48.55,58 48.1,58.45 45.31,58.45 45.28,58.48 45.18,58.48 42.93,60.72 42.93,63.89 45.72,66.68 LATCH4.2
  Bottom 0.203: LATCH6.2 48.34,57.73 48.34,57.77 v48.55,57.98
N$10  (via drill 0.3 pad 0.61)
  Top 0.203: ATMEGA16.25 33.67,38.11 37.91,42.35 37.91,44.31 44.14,50.55 LATCH5.3 48.31,50.55 49.54,51.78 49.54,58.1 v48.58,59.07 48.58,60.32 49.22,60.96 49.22,61.62 48.63,62.21 45.88,62.21 45.72,62.37 45.72,65.41 LATCH4.3
  Bottom 0.203: v48.58,59.07 48.51,59 48.34,59 47.69,59 LATCH6.3
N$11  (via drill 0.3 pad 0.61)
  Top 0.203: 48.31,49.28 50.31,51.27 50.31,62.54 v49.64,63.21 48.71,64.14 48.31,64.14 LATCH4.4 | 48.31,49.28 48.31,46.22 48.22,46.13 42.19,46.13 42.12,46.2 41.58,46.2 41.31,45.93 41.31,45.53 39.77,43.98 v38.95,43.98 | ATMEGA16.24 34.47,37.61 35.77,38.92 v36.97,38.92 | LATCH5.4 48.31,49.28
  Bottom 0.203: v36.97,38.92 38.95,40.9 v38.95,43.98 | v49.64,63.21 49.64,61.48 48.43,60.27 48.34,60.27 LATCH6.4
N$12  (via drill 0.3 pad 0.61)
  Top 0.203: 45.72,48.01 45.72,49.73 45.93,49.94 48.27,49.94 49.92,51.59 49.92,59.57 v49.59,59.9 49.61,59.93 49.61,61.81 48.56,62.86 48.31,62.86 LATCH4.5 | 45.72,48.01 42.14,48.01 38.34,44.21 38.34,39.44 36.52,37.61 35.27,37.61 ATMEGA16.23 | 45.72,48.01 45.81,48.01 LATCH5.5
  Bottom 0.203: v49.59,59.9 49.34,59.66 45.91,59.66 45.74,59.83 45.74,61.54 LATCH6.5
N$13  (via drill 0.3 pad 0.61)
  Top 0.203: v40.73,45.77 40.73,45.91 41.55,46.74 45.72,46.74 LATCH5.6 | v38.65,35.02 38.33,35.02 38.1,34.78 ATMEGA16.22 | v48.64,61.38 48.53,61.38 48.31,61.59 LATCH4.6
  Bottom 0.203: v38.65,35.02 40.41,36.77 40.41,45.45 v40.73,45.77 40.73,62.09 45.88,67.23 48.17,67.23 48.72,66.69 48.72,63.2 48.34,62.81 | v48.64,61.38 48.64,62.51 48.34,62.81 | LATCH6.6 48.34,62.81
N$14  (via drill 0.3 pad 0.61)
  Top 0.203: v41.9,45.59 45.59,45.59 45.72,45.47 LATCH5.7 | v44.67,60.54 45.5,60.54 45.72,60.32 LATCH4.7 | v39.83,34.11 38.22,34.11 38.1,33.98 ATMEGA16.21
  Bottom 0.203: v39.83,34.11 41.48,35.77 41.48,42.96 41.7,43.18 41.7,45.39 v41.9,45.59 41.9,57.77 v44.67,60.54 44.67,63.01 45.74,64.08 LATCH6.7
N$15  (via drill 0.3 pad 0.61)
  Top 0.203: v43.53,61.02 43.53,60.81 45.29,59.05 45.72,59.05 LATCH4.8 | v41.02,44.2 45.72,44.2 LATCH5.8 | ATMEGA16.20 38.1,33.18 38.11,33.2 v39.15,33.2
  Bottom 0.203: v39.15,33.2 39.15,34.44 41.02,36.32 v41.02,44.2 41.31,44.49 41.31,58.81 v43.53,61.02 43.53,63.14 45.74,65.35 LATCH6.8
N$16  (via drill 0.3 pad 0.61)
  Top 0.203: ATMEGA16.19 39.2,32.38 42.07,35.26 v42.07,42.72 45.52,42.72 45.72,42.93 LATCH5.9 | LATCH4.9 45.72,57.78 45.61,57.89 v45.04,57.89
  Bottom 0.203: v42.07,42.72 42.25,42.91 42.25,45.12 42.48,45.35 42.48,55.34 v45.04,57.89 45.36,58.22 45.36,62.93 45.91,63.47 48.17,63.47 48.34,63.64 48.34,65.86 47.57,66.62 LATCH6.9
N$17  (via drill 0.3 pad 0.61)
  Top 0.203: 45.65,36.45 39.19,29.98 ATMEGA16.16 | 45.65,36.45 v45.65,37.01 | 45.65,36.45 45.85,36.45 LATCH8.2
  Bottom 0.203: 45.77,37.16 45.65,37.05 v45.65,37.01 | 45.77,37.16 48.33,37.16 50.01,35.48 50.01,29.21 48.46,27.66 LATCH9.2 | 45.77,37.16 45.72,37.2 45.72,43 LATCH7.2
N$18  (via drill 0.3 pad 0.61)
  Top 0.203: ATMEGA16.15 38.99,29.19 44.91,35.1 v45.63,35.1 45.77,35.1 45.85,35.18 LATCH8.3
  Bottom 0.203: 45.63,35.94 v45.63,35.1 | 45.63,35.94 45.06,36.51 45.06,43.61 45.72,44.27 LATCH7.3 | 45.63,35.94 48.28,35.94 49.25,34.98 49.25,29.72 48.46,28.93 LATCH9.3
N$19  (via drill 0.3 pad 0.61)
  Top 0.203: ATMEGA16.14 38.85,28.39 43.68,33.21 v44.12,33.21 44.81,33.91 45.85,33.91 LATCH8.4
  Bottom 0.203: LATCH9.4 44.9,30.2 44.12,30.98 v44.12,33.21 43.9,33.43 43.9,44.61 44.01,44.72 44.01,48.18 45.81,49.99 48.17,49.99 48.31,49.84 48.31,47.64 48.15,47.47 45.93,47.47 45.72,47.27 45.72,45.54 LATCH7.4
N$20  (via drill 0.3 pad 0.61)
  Top 0.203: ATMEGA16.13 38.88,27.59 v43.05,31.75 43.1,31.81 v45.63,31.81 45.63,32.43 45.85,32.64 LATCH8.5
  Bottom 0.203: v43.05,31.75 43.05,44.83 43.25,45.03 43.25,48.6 45.92,51.28 48.13,51.28 48.69,50.72 48.69,47.19 48.31,46.81 LATCH7.5 | LATCH9.5 45.87,31.47 45.87,31.58 v45.63,31.81
N$21  (via drill 0.3 pad 0.61)
  Top 0.203: ATMEGA16.12 38.8,26.79 42.93,30.92 v45.05,30.92 46.69,30.92 LATCH8.6
  Bottom 0.203: v45.05,30.92 45.05,32.08 45.71,32.74 LATCH9.6 47.82,32.74 48.46,32.74 48.46,34.48 48.32,34.63 46,34.63 45.87,34.49 45.4,34.49 44.67,35.22 44.67,44.3 44.77,44.4 44.77,47.13 45.72,48.08 LATCH7.6
N$22  (via drill 0.3 pad 0.61)
  Top 0.203: 54.65,26.29 v49.71,26.29 | LATCH8.11 54.65,26.29 | 54.65,26.29 54.65,40.53 55.78,41.66 LATCH5.11 | v26.83,27.01 26.73,27.01 26.5,26.79 ATMEGA16.44
  Bottom 0.203: v49.71,26.29 49.2,25.78 28.06,25.78 v26.83,27.01 26.77,27.07 26.77,42.84 26.98,43.04 26.98,52.65 26.37,53.26 LATCH2.11
N$23  (via drill 0.3 pad 0.61)
  Top 0.203: v39.53,53.29 36.5,53.29 LATCH1.11 36.5,57.48 35.79,58.19 35.79,60.63 43.71,68.56 48.17,68.56 51.33,65.4 51.33,56.82 55.67,52.48 58.28,52.48 58.37,52.56 v58.37,53.9 58.37,56.52 LATCH4.11 | v30.09,27.59 30.05,27.63 26.54,27.63 26.5,27.59 ATMEGA16.43
  Bottom 0.203: v30.09,27.59 39.53,37.04 v39.53,53.29 | v58.37,53.9 58.37,53.16 LATCH7.11
N$24
  Bottom 0.203: ULN2.1 LATCH2.19
N$25
  Bottom 0.203: ULN2.2 LATCH2.18
N$26
  Bottom 0.203: ULN2.3 LATCH2.17
N$27
  Bottom 0.203: ULN2.4 LATCH2.16
N$28
  Bottom 0.203: ULN2.5 LATCH2.15
N$29
  Bottom 0.203: ULN2.6 LATCH2.14
N$30
  Bottom 0.203: ULN2.7 LATCH2.13
N$31
  Bottom 0.203: ULN2.8 LATCH2.12
N$32
  Top 0.203: LATCH1.19 26.34,55.88 26.29,55.93 ULN1.1
N$33
  Top 0.203: LATCH1.18 27.61,55.88 27.56,55.93 ULN1.2
N$34
  Top 0.203: LATCH1.17 28.88,55.88 28.83,55.93 ULN1.3
N$35
  Top 0.203: LATCH1.16 30.15,55.88 30.1,55.93 ULN1.4
N$36
  Top 0.203: LATCH1.15 31.42,55.88 31.37,55.93 ULN1.5
N$37
  Top 0.203: LATCH1.14 32.69,55.88 32.64,55.93 ULN1.6
N$38
  Top 0.203: LATCH1.13 33.96,55.88 33.91,55.93 ULN1.7
N$39
  Top 0.203: LATCH1.12 35.23,55.88 35.18,55.93 ULN1.8
N$40
  Top 0.203: LATCH5.19 58.37,51.82 58.42,51.77 ULN5.1
N$41
  Top 0.203: LATCH5.18 58.37,50.55 58.42,50.49 ULN5.2
N$42
  Top 0.203: LATCH5.17 58.37,49.28 58.42,49.22 ULN5.3
N$43
  Top 0.203: LATCH5.16 58.37,48.01 58.42,47.95 ULN5.4
N$44
  Top 0.203: LATCH5.15 58.37,46.74 58.42,46.68 ULN5.5
N$45
  Top 0.203: LATCH5.14 58.37,45.47 58.42,45.41 ULN5.6
N$46
  Top 0.203: LATCH5.13 58.37,44.2 58.42,44.14 ULN5.7
N$47  (via drill 0.3 pad 0.61)
  Top 0.203: v8.1,31.72 8.03,31.65 7.87,31.65 LATCH3.19
  Bottom 0.203: ULN3.1 6.5,33.32 v8.1,31.72
N$48
  Top 0.203: LATCH4.19 58.37,66.68 58.42,66.73 ULN4.1
N$49
  Top 0.203: LATCH4.18 58.37,65.41 58.42,65.46 ULN4.2
N$50
  Top 0.203: LATCH4.17 58.37,64.14 58.42,64.19 ULN4.3
N$51
  Top 0.203: LATCH4.16 58.37,62.86 58.42,62.92 ULN4.4
N$52
  Top 0.203: LATCH4.15 58.37,61.59 58.42,61.65 ULN4.5
N$53
  Top 0.203: LATCH4.14 58.37,60.32 58.42,60.38 ULN4.6
N$54
  Top 0.203: LATCH4.13 58.37,59.05 58.42,59.11 ULN4.7
N$55
  Top 0.203: LATCH4.12 58.37,57.78 58.42,57.84 ULN4.8
N$56
  Top 0.203: LATCH8.19 58.5,36.45 58.55,36.5 ULN8.1
N$57
  Top 0.203: LATCH8.18 58.5,35.18 58.55,35.23 ULN8.2
N$58
  Top 0.203: LATCH8.17 58.5,33.91 58.55,33.96 ULN8.3
N$59
  Top 0.203: LATCH8.16 58.5,32.64 58.55,32.69 ULN8.4
N$60
  Top 0.203: LATCH8.15 58.5,31.37 58.55,31.42 ULN8.5
N$61  (via drill 0.3 pad 0.61)
  Top 0.203: v8.1,32.92 7.87,32.92 LATCH3.18
  Bottom 0.203: v8.1,32.92 7.8,33.22 7.8,35.13 ULN3.2
N$62
  Top 0.203: ULN4.18 72.47,66.73 73.3,67.56 X3.2
N$63  (via drill 0.3 pad 0.61)
  Top 0.203: v5.02,35.68 5.28,35.42 5.28,34.19 LATCH3.17
  Bottom 0.203: v5.02,35.68 5.02,36.21 5.21,36.4 ULN3.3
N$64
  Bottom 0.203: LATCH7.19 58.37,43 58.47,42.9 ULN7.1
N$65
  Bottom 0.203: LATCH7.18 58.37,44.27 58.47,44.17 ULN7.2
N$66
  Bottom 0.203: LATCH7.17 58.37,45.54 58.47,45.44 ULN7.3
N$67
  Bottom 0.203: LATCH7.16 58.37,46.81 58.47,46.71 ULN7.4
N$68
  Bottom 0.203: LATCH7.15 58.37,48.08 58.47,47.98 ULN7.5
N$69  (via drill 0.3 pad 0.61)
  Top 0.203: v8.08,35.76 8.08,35.67 7.87,35.46 LATCH3.16
  Bottom 0.203: v8.08,35.76 7.8,36.04 7.8,37.67 ULN3.4
N$70  (via drill 0.3 pad 0.61)
  Top 0.203: v5.07,37.03 5.28,36.82 5.28,36.73 LATCH3.15
  Bottom 0.203: v5.07,37.03 5.21,37.17 5.21,38.94 ULN3.5
N$71  (via drill 0.3 pad 0.61)
  Top 0.203: v8.1,38.32 7.87,38.1 7.87,38 LATCH3.14
  Bottom 0.203: ULN3.6 6.97,40.21 8.1,39.08 v8.1,38.32
N$72  (via drill 0.3 pad 0.61)
  Top 0.203: v5.06,39.57 5.28,39.35 5.28,39.27 LATCH3.13
  Bottom 0.203: v5.06,39.57 5.21,39.72 5.21,41.48 ULN3.7
N$73  (via drill 0.3 pad 0.61)
  Top 0.203: LATCH3.12 5.28,40.54 5.28,41.76 v4.98,42.06
  Bottom 0.203: v4.98,42.06 4.98,42.52 5.21,42.75 ULN3.8
N$74  (via drill 0.3 pad 0.61)
  Top 0.203: LATCH3.11 7.87,41.81 9.38,40.3 9.38,35.66 15.99,29.05 v21.49,29.05 | ATMEGA16.11 35.27,23.96 39.5,23.96 v40.28,24.73
  Bottom 0.203: 55.93,37.82 55.93,31.67 48.99,24.73 v40.28,24.73 25.81,24.73 v21.49,29.05 | LATCH6.11 55.8,67.89 55.14,67.23 55.14,38.61 55.93,37.82 | LATCH9.11 55.93,37.82
N$75
  Bottom 0.203: LATCH6.19 58.39,57.73 58.55,57.89 ULN6.1
N$76
  Bottom 0.203: LATCH6.18 58.39,59 58.55,59.16 ULN6.2
N$77
  Bottom 0.203: LATCH6.17 58.39,60.27 58.55,60.43 ULN6.3
N$78
  Bottom 0.203: LATCH6.16 58.39,61.54 58.55,61.7 ULN6.4
N$79
  Bottom 0.203: LATCH6.15 58.39,62.81 58.55,62.97 ULN6.5
N$80
  Bottom 0.203: LATCH6.14 58.39,64.08 58.55,64.24 ULN6.6
N$81
  Bottom 0.203: LATCH6.13 58.39,65.35 58.55,65.51 ULN6.7
N$82
  Bottom 0.203: LATCH6.12 58.39,66.62 58.55,66.78 ULN6.8
N$84
  Bottom 0.203: LATCH9.19 58.52,27.66 58.6,27.58 ULN9.1
N$85
  Bottom 0.203: LATCH9.18 58.52,28.93 58.6,28.85 ULN9.2
N$86
  Bottom 0.203: LATCH9.17 58.52,30.2 58.6,30.12 ULN9.3
N$87
  Bottom 0.203: LATCH9.16 58.52,31.47 58.6,31.39 ULN9.4
N$88
  Bottom 0.203: LATCH9.15 58.52,32.74 58.6,32.66 ULN9.5
N$89
  Bottom 0.203: LATCH9.14 58.52,34.01 58.6,33.93 ULN9.6
N$90
  Bottom 0.203: LATCH9.13 58.52,35.28 58.6,35.2 ULN9.7
N$91
  Bottom 0.203: LATCH9.12 58.52,36.55 58.6,36.47 ULN9.8
N$92
  Bottom 0.203: X2.2 8.25,48.78 8.68,48.35 8.68,42.44 15.38,35.75 17.73,35.75 17.86,35.62 17.86,33.86 ULN3.18
N$93
  Bottom 0.203: ULN3.17 15.26,35.13 8.28,42.11 8.28,45.7 4.63,49.35 4.63,50.23 5.71,51.32 X2.3
N$94
  Bottom 0.203: ULN3.16 15.26,36.4 9.67,41.99 9.67,49.9 8.25,51.32 X2.4
N$95
  Bottom 0.203: X2.6 10.43,52.71 10.43,44.5 15.38,39.56 17.69,39.56 17.86,39.39 17.86,37.67 ULN3.15
N$96
  Bottom 0.203: ULN3.14 15.26,38.94 10.05,44.15 10.05,52.02 8.46,53.62 8.02,53.62 6.75,54.89 6.75,55.36 5.71,56.4 X2.7
N$97
  Bottom 0.203: ULN3.13 15.26,40.21 10.81,44.66 10.81,53.84 8.25,56.4 X2.8
N$98
  Bottom 0.203: 11.53,45.21 11.53,55.66 8.25,58.94 X2.10 | 11.53,45.21 | 11.53,45.21 15.26,41.48 ULN3.12
N$99
  Bottom 0.203: ULN3.11 15.26,42.75 12.08,45.93 12.08,57.65 8.26,61.48 7.78,61.48 6.75,62.51 X2.11
N$100
  Bottom 0.203: X2.12 8.25,63.54 15.5,70.79 31.93,70.79 32.08,70.64 32.08,68.37 32.25,68.2 36.52,68.2 ULN2.18
N$101
  Bottom 0.203: ULN2.17 35.25,70.79 34.07,71.98 8.6,71.98 4.67,68.05 4.67,67.12 5.71,66.08 6.19,66.08 7.22,65.05 X2.14
N$102
  Bottom 0.203: X2.15 6.75,67.59 10.72,71.56 33.21,71.56 33.98,70.79 ULN2.16
N$103
  Bottom 0.203: ULN2.15 32.71,70.79 32.33,71.17 12.87,71.17 9.29,67.59 X2.16
N$104
  Bottom 0.203: X1.2 17.14,50.82 17.71,50.82 25.36,58.47 25.36,60.18 31.45,66.27 ULN2.14
N$105
  Top 0.203: ATMEGA16.3 28.87,23.96 19.71,14.8 16.97,14.8 15.92,15.85 SERWIS.7
N$106
  Top 0.203: SERWIS.9 19.96,15.85 28.07,23.96 ATMEGA16.2
N$107
  Top 0.203: ATMEGA16.1 27.27,23.96 20.2,16.88 9.33,16.88 8.3,15.85 SERWIS.1
N$108
  Bottom 0.203: ULN2.13 30.18,66.08 24.89,60.8 24.89,58.55 17.6,51.27 16.7,51.27 15.64,52.32 X1.3
N$109
  Bottom 0.203: X1.4 17.14,53.36 18.18,54.39 18.18,55.61 28.91,66.34 ULN2.12
N$110
  Top 0.203: LATCH5.12 58.37,42.93 58.42,42.88 ULN5.8
N$111
  Bottom 0.203: X1.6 17.14,55.9 27.64,66.39 ULN2.11
N$112  (via drill 0.3 pad 0.61)
  Top 0.203: v25.79,67.99 26.05,68.25 26.29,68.25 ULN1.18
  Bottom 0.203: v25.79,67.99 19.02,61.21 16.91,61.21 15.64,59.94 15.64,59.47 14.6,58.44 X1.7
N$113  (via drill 0.3 pad 0.61)
  Top 0.203: v27.05,68.02 27.28,68.25 27.56,68.25 ULN1.17
  Bottom 0.203: v27.05,68.02 17.47,58.44 17.14,58.44 X1.8
N$115
  Top 0.203: ULN1.16 28.83,70.84 29.21,71.22 32.8,71.22 33.29,70.73 33.29,68.4 24.84,59.94 X1.10
N$116
  Top 0.203: X1.11 14.6,63.52 15.64,64.55 15.64,65.02 17.07,66.46 27.54,66.46 30.1,69.02 ULN1.15
N$117  (via drill 0.3 pad 0.61)
  Top 0.203: ATMEGA16.8 32.87,22.08 33.73,21.22 C4.2 33.73,19.45 33.73,18.86 33.8,18.86 v34.02,18.64
  Bottom 0.203: Q1.1 37.24,15.37 34.02,18.59 v34.02,18.64
N$118  (via drill 0.3 pad 0.61)
  Top 0.203: ATMEGA16.7 32.07,22.07 31.22,21.22 C3.2 v31.22,18.63
  Bottom 0.203: Q1.2 27.58,15.37 27.95,15.37 v31.22,18.63
N$119  (via drill 0.3 pad 0.61)
  Top 0.203: FT232RL.15 52.7,21.19 52.95,21.44 v57.02,21.44
  Bottom 0.203: X7.3 62.55,15.91 v57.02,21.44
N$120  (via drill 0.3 pad 0.61)
  Top 0.203: FT232RL.1 v54.88,12.74 | v41.14,21.39 36.23,21.39 33.67,23.96 ATMEGA16.9
  Bottom 0.203: v41.14,21.39 49.79,12.74 v54.88,12.74
N$121  (via drill 0.3 pad 0.61)
  Top 0.203: FT232RL.5 v54.05,15.34 | v40.94,23.07 35.35,23.07 34.47,23.96 ATMEGA16.10
  Bottom 0.203: v40.94,23.07 48.67,15.34 v54.05,15.34
N$122  (via drill 0.3 pad 0.61)
  Top 0.203: v55.23,19.14 53.84,20.54 FT232RL.16
  Bottom 0.203: X7.2 60.47,13.91 v55.23,19.14
N$123
  Top 0.203: L1.1 7.39,20.46 6.23,19.3 6.23,15.42 7.31,14.34 19.81,14.34 26.52,7.63 52,7.63 55.78,11.41 X7.1
N$124
  Top 0.203: LATCH8.14 58.5,30.1 58.55,30.15 ULN8.6
N$125
  Top 0.203: FT232RL.19 50.64,18.59 49.13,18.59 46.93,16.39 | R3.2 45.84,16.42 45.86,16.39 46.93,16.39 | R2.1 46.93,16.39
N$126
  Top 0.203: C5.1 48.55,19.53 48.91,19.89 FT232RL.17
N$127  (via drill 0.3 pad 0.61)
  Top 0.203: v15.51,19.62 17.19,19.62 17.7,20.13 17.7,21.06 R1.1 21.56,21.06 26.52,26.01 29.67,26.01 ATMEGA16.4
  Bottom 0.203: SERWIS.5 12.34,16.88 12.77,16.88 v15.51,19.62
N$128
  Top 0.203: LATCH8.13 58.5,28.83 58.55,28.88 ULN8.7
N$129
  Top 0.203: LATCH8.12 58.5,27.56 58.55,27.61 ULN8.8
N$130
  Bottom 0.203: LATCH7.14 58.37,49.35 58.47,49.25 ULN7.6
N$131
  Bottom 0.203: LATCH7.13 58.37,50.62 58.47,50.52 ULN7.7
N$132
  Bottom 0.203: LATCH7.12 58.37,51.89 58.47,51.79 ULN7.8
N$133
  Top 0.203: X1.12 25.6,62.48 31.37,68.25 ULN1.14
N$134
  Top 0.203: ULN1.13 32.64,70.84 30.91,70.84 30.71,70.64 30.71,68.41 27.32,65.02 X1.14
N$135  (via drill 0.3 pad 0.61)
  Top 0.203: ULN1.12 33.91,70.84 33.1,71.65 24.8,71.65 v22.41,69.27
  Bottom 0.203: X1.15 15.64,67.56 17.34,69.27 v22.41,69.27
N$136
  Top 0.203: ULN1.11 35.18,70.84 33.98,72.03 22.65,72.03 18.18,67.56 X1.16
N$137
  Top 0.203: ULN4.17 72.47,65.46 73.08,66.06 80.07,66.06 81.11,65.02 X3.3
N$144  (via drill 0.3 pad 0.61)
  Top 0.203: v42.42,29.56 42.96,30.1 45.94,30.1 LATCH8.7 48.44,30.1 48.44,33.1 48.29,33.25 v45.33,33.25 | v32.88,28.2 26.68,28.2 26.5,28.39 ATMEGA16.42
  Bottom 0.203: 45.33,34.01 44.29,35.05 44.29,44.46 44.39,44.56 44.39,48.02 45.72,49.35 LATCH7.7 | v32.88,28.2 41.06,28.2 v42.42,29.56 | 45.33,34.01 45.87,34.01 LATCH9.7 | 45.33,34.01 v45.33,33.25
N$145  (via drill 0.3 pad 0.61)
  Top 0.203: LATCH8.8 46.49,28.83 44.67,28.83 v44.6,28.75 41.69,25.84 36.07,25.84 32.73,29.19 26.5,29.19 ATMEGA16.41
  Bottom 0.203: 44.82,29.59 43.63,30.78 43.63,32.65 43.51,32.76 43.51,44.76 43.63,44.88 43.63,48.4 45.84,50.62 LATCH7.8 | 44.82,29.59 44.82,28.98 v44.6,28.75 | 44.82,29.59 48.33,29.59 48.87,30.13 48.87,34.63 48.21,35.28 LATCH9.8
N$146  (via drill 0.3 pad 0.61)
  Top 0.203: ATMEGA16.40 32.47,29.98 36.23,26.22 40.75,26.22 v43.66,29.13 43.97,29.44 48.31,29.44 48.44,29.31 48.44,27.56 LATCH8.9
  Bottom 0.203: LATCH9.9 48.21,36.55 49.63,35.13 49.63,29.52 48.43,28.32 44.99,28.32 44.84,28.17 44.36,28.17 43.66,28.86 v43.66,29.13 43.66,29.16 42.46,30.36 42.46,42.29 42.65,42.48 42.65,44.98 42.86,45.19 42.86,49.04 45.72,51.89 LATCH7.9
N$154
  Top 0.203: X3.4 78.57,65.02 77.73,64.19 ULN4.16
N$155
  Top 0.203: ULN4.15 72.47,62.92 72.9,62.48 X3.6
N$156
  Top 0.203: ULN4.14 72.47,61.65 73.08,61.04 80.02,61.04 81.11,59.94 X3.7
N$157
  Top 0.203: ULN4.13 72.47,60.38 72.9,59.94 X3.8
N$158
  Top 0.203: ULN4.12 72.47,59.11 76.87,59.11 78.57,57.4 X3.10
N$159
  Top 0.203: ULN4.11 74.64,57.84 76.58,55.9 80.08,55.9 81.11,54.86 X3.11
N$160
  Top 0.203: X3.12 75.56,54.86 72.47,51.77 ULN5.18
N$161
  Top 0.203: X3.14 75.62,52.32 73.79,50.49 ULN5.17
N$162
  Top 0.203: X3.15 81.11,49.78 80.03,50.87 76.42,50.87 74.77,49.22 ULN5.16
N$163
  Top 0.203: X3.16 78.57,49.78 76.74,47.95 ULN5.15
N$164  (via drill 0.3 pad 0.61)
  Top 0.203: v74.89,44.18 74.26,44.8 70,44.8 69.88,44.93 69.88,46.68 ULN5.14
  Bottom 0.203: v74.89,44.18 79.05,40.02 79.63,40.02 X4.2
N$165  (via drill 0.3 pad 0.61)
  Top 0.203: ULN5.13 76.62,45.41 v77.86,44.18
  Bottom 0.203: X4.3 83.23,37.51 83.23,39.41 78.46,44.18 v77.86,44.18
N$166  (via drill 0.3 pad 0.61)
  Top 0.203: ULN5.12 72.47,44.14 72.67,43.94 v73.39,43.94
  Bottom 0.203: X4.4 79.63,37.48 73.39,43.72 v73.39,43.94
N$167  (via drill 0.3 pad 0.61)
  Top 0.203: v69.63,42.88 69.88,42.88 ULN5.11
  Bottom 0.203: X4.6 77.06,33.91 73.83,37.13 69.9,37.13 69.63,37.41 v69.63,42.88
N$168
  Bottom 0.203: ULN6.18 69.88,57.89 67.94,55.96 67.94,37.81 69.94,35.81 72.27,35.81 72.49,35.59 72.49,35.52 75.61,32.4 80.1,32.4 81.14,31.37 X4.7
N$169
  Bottom 0.203: X4.8 78.59,31.37 78.42,31.54 75.78,31.54 72.78,34.55 69.27,34.55 67.56,36.25 67.56,56.84 69.88,59.16 ULN6.17
N$170
  Bottom 0.203: X4.10 78.15,28.83 76.2,30.78 75.35,30.78 72.86,33.27 69.94,33.27 67.18,36.03 67.18,57.73 69.88,60.43 ULN6.16
N$171
  Bottom 0.203: ULN6.15 69.88,61.7 66.8,58.62 66.8,32.59 69.93,29.47 74.25,29.47 76.4,27.32 80.1,27.32 81.14,26.29 X4.11
N$172
  Bottom 0.203: X4.12 75.6,26.29 73.69,28.19 69.94,28.19 66.42,31.71 66.42,59.51 69.88,62.97 ULN6.14
N$173
  Bottom 0.203: X4.14 73.16,23.75 66.04,30.87 66.04,60.4 69.88,64.24 ULN6.13
N$174
  Bottom 0.203: ULN6.12 69.88,65.51 65.66,61.29 65.66,30.71 74.13,22.24 80.1,22.24 81.14,21.21 X4.15
N$175
  Bottom 0.203: X4.16 74.62,21.21 65.28,30.56 65.28,62.18 69.88,66.78 ULN6.11
N$176
  Bottom 0.203: ULN7.18 70.62,42.9 68.33,45.19 68.33,54.14 70.07,55.88 71.09,55.88 76.66,61.45 82.67,61.45 87.83,66.61 88.44,66.61 X5.2
N$177
  Bottom 0.203: ULN7.17 72.44,44.17 73.03,44.76 87.35,44.76 92.85,50.27 92.85,62.2 90.98,64.07 X5.3
N$178
  Bottom 0.203: ULN7.16 69.85,45.44 68.71,46.58 68.71,53.98 70.23,55.5 71.25,55.5 76.77,61.02 83.33,61.02 87.41,65.1 X5.4
N$179
  Bottom 0.203: X5.6 87.41,62.56 83.75,58.9 75.24,58.9 71.47,55.12 70.39,55.12 69.09,53.82 69.09,47.47 69.85,46.71 ULN7.15
N$180
  Bottom 0.203: X5.7 90.98,58.99 92.47,57.5 92.47,51.84 91.53,50.9 76.48,50.9 73.56,47.98 ULN7.14
N$181
  Bottom 0.203: ULN7.13 69.85,49.25 69.47,49.63 69.47,53.67 70.41,54.61 72.45,54.61 76.36,58.52 85.91,58.52 87.41,60.02 X5.8
N$182
  Bottom 0.203: 85.91,55.98 74.36,55.98 72.49,54.1 70.45,54.1 69.85,53.51 69.85,50.52 ULN7.12 | 85.91,55.98 | 85.91,55.98 87.41,57.48 X5.10
N$183
  Bottom 0.203: ULN7.11 72.44,51.79 72.95,51.28 91.37,51.28 92.05,51.97 92.05,53.87 X5.11
N$184
  Top 0.203: ULN8.18 72.44,36.5 72.44,37.9 88.44,53.91 X5.12
N$185
  Top 0.203: ULN8.17 72.44,35.23 72.44,35.51 88.3,51.37 88.44,51.37 X5.14
N$186  (via drill 0.3 pad 0.61)
  Top 0.203: v83.11,45.36 72.44,34.68 72.44,33.96 ULN8.16
  Bottom 0.203: v83.11,45.36 85.45,45.36 89.95,49.86 X5.15
N$187
  Top 0.203: X5.16 87.41,49.86 87.41,48.83 72.91,34.32 72.91,33.87 71.73,32.69 ULN8.15
N$188
  Top 0.203: ULN8.14 72.44,31.42 75.74,34.72 75.74,36.62 79.15,40.03 86.47,40.03 87.41,39.09 X6.2
N$189
  Top 0.203: ULN8.13 72.44,30.15 72.44,30.76 79.27,37.59 88.91,37.59 89.95,36.55 X6.3
N$190
  Top 0.203: ULN8.12 72.44,28.88 78.74,35.18 86.04,35.18 87.41,36.55 X6.4
N$191
  Top 0.203: ULN8.11 72.44,27.61 72.44,27.95 77.13,32.64 86.04,32.64 87.41,34.01 X6.6
N$192
  Bottom 0.203: ULN9.18 72.37,27.58 75.06,24.88 84.31,24.88 86.4,22.79 91.4,22.79 92.06,23.45 92.06,29.36 90.98,30.44 X6.7
N$193  (via drill 0.3 pad 0.61)
  Top 0.203: v74.11,28.79 75.66,30.34 86.27,30.34 87.41,31.47 X6.8
  Bottom 0.203: v74.11,28.79 72.43,28.79 72.37,28.85 ULN9.17
N$194  (via drill 0.3 pad 0.61)
  Top 0.203: v75.88,29.69 76.08,29.89 86.45,29.89 87.41,28.93 X6.10
  Bottom 0.203: v75.88,29.69 75.72,29.85 72.64,29.85 72.37,30.12 ULN9.16
N$195  (via drill 0.3 pad 0.61)
  Top 0.203: v69.53,30.7 69.53,26.19 70.49,25.23 88.79,25.23 89.95,26.39 X6.11
  Bottom 0.203: v69.53,30.7 69.53,31.15 69.77,31.39 ULN9.15
N$196
  Bottom 0.203: ULN9.14 72.93,32.66 75.19,30.4 76.04,30.4 78.7,27.74 81.25,27.74 81.63,27.36 86.44,27.36 87.41,26.39 X6.12
N$197  (via drill 0.3 pad 0.61)
  Top 0.203: X6.14 89.64,25.04 91.11,25.04 92.02,25.96 92.02,26.82 91.06,27.78 v86.87,27.78
  Bottom 0.203: v86.87,27.78 81.75,27.78 80.66,28.87 80.66,29.33 79.79,30.21 77.31,30.21 76.36,31.16 75.56,31.16 72.79,33.93 ULN9.13
N$198  (via drill 0.3 pad 0.61)
  Top 0.203: v69.52,35.13 68.48,34.09 68.48,26.09 74.45,20.12 88.76,20.12 89.95,21.31 X6.15
  Bottom 0.203: ULN9.12 69.59,35.2 v69.52,35.13
N$199  (via drill 0.3 pad 0.61)
  Top 0.203: v74.2,34.65 74.2,33.93 72.29,32.03 69.95,32.03 68.9,30.98 68.9,26.24 72.51,22.62 86.1,22.62 87.41,21.31 X6.16
  Bottom 0.203: v74.2,34.65 72.37,36.47 ULN9.11
N$200
  pour Top: 95.5,73.79 95.38,0 0,-0.08 0.08,73.76
VCC  (via drill 0.3 pad 0.61)
  Top 0.305: v55.73,38.92 55.73,37.85 55.85,37.72 | v55.24,30.13 55.24,37.1 55.85,37.72 | LATCH8.20 55.85,37.72 | ATMEGA16.27 32.07,36.04 32.07,35.5 32.07,34.68 | 25.07,53.24 22.89,51.05 16.81,51.05 15.69,49.93 15.69,49.31 14.54,48.16 10.16,48.16 4.3,42.3 4.3,31.31 5.23,30.38 LATCH3.20 7.92,30.38 7.92,26.05 | v23.15,31.61 24.36,31.61 24.39,31.59 ATMEGA16.38 28.97,31.59 32.07,34.68 | 32.07,34.68 32.09,34.68 35.99,30.79 ATMEGA16.17 | 25.07,53.24 35.76,53.24 v35.86,53.14 | 25.07,53.24 25.07,53.36 LATCH1.20 | 15.59,25.93 8.05,25.93 7.92,26.05 | 7.92,26.05 7.39,25.51 L1.2 7.39,23.25 6.83,23.25 5.78,22.2 5.78,14.8 SERWIS.2 | FT232RL.20 50.59,17.94 50.59,17.64 R2.2 47.45,12.66 47.42,12.64 C6.1 52.73,11.51 55.91,14.69 FT232RL.4 59.34,14.69 60,14.69 61.92,12.77 74.4,12.77 78.87,8.3 78.87,7.55 80.67,5.75 82.56,5.75 84.89,8.08 ZASILANIE.1 | LATCH4.20 55.73,67.95 v55.73,53.96 55.73,53.09 LATCH5.20 | 15.59,25.93 15.59,21.22 15.75,21.06 R1.2 | 15.59,25.93 C2.+ 19.42,26.87 19.57,27.03 C1.1 | v29.49,23.74 30.3,23.74 30.47,23.91 ATMEGA16.5
  Bottom 0.305: 55.73,41.73 v55.73,38.92 | 55.24,26.39 v55.24,30.13 | 55.24,26.39 52.58,23.74 v29.49,23.74 25.91,23.74 20.59,29.05 | 55.24,26.39 55.88,26.39 LATCH9.20 57.9,26.39 58.57,26.39 58.57,24.19 65.54,17.23 66.98,17.23 69.38,14.83 69.38,12 75.65,5.73 82.54,5.73 84.89,8.08 ZASILANIE.1 | C2.+ 18.37,26.87 20.55,29.05 20.59,29.05 | 20.59,29.05 | 20.59,29.05 v23.15,31.61 | LATCH2.20 37.79,53.21 35.94,53.21 v35.86,53.14 | 55.73,41.73 v55.73,53.96 55.73,56.44 55.75,56.46 LATCH6.20 | LATCH7.20 55.73,41.73

### Text on the board
tNames: Xenlight v3
bNames: 12V | 5V | Dawid Karczewski 2014